# EAGLE design I2C_IR (EAGLE 6.3)
DATABASE: ./../../eagle/PARTSDB.TXT
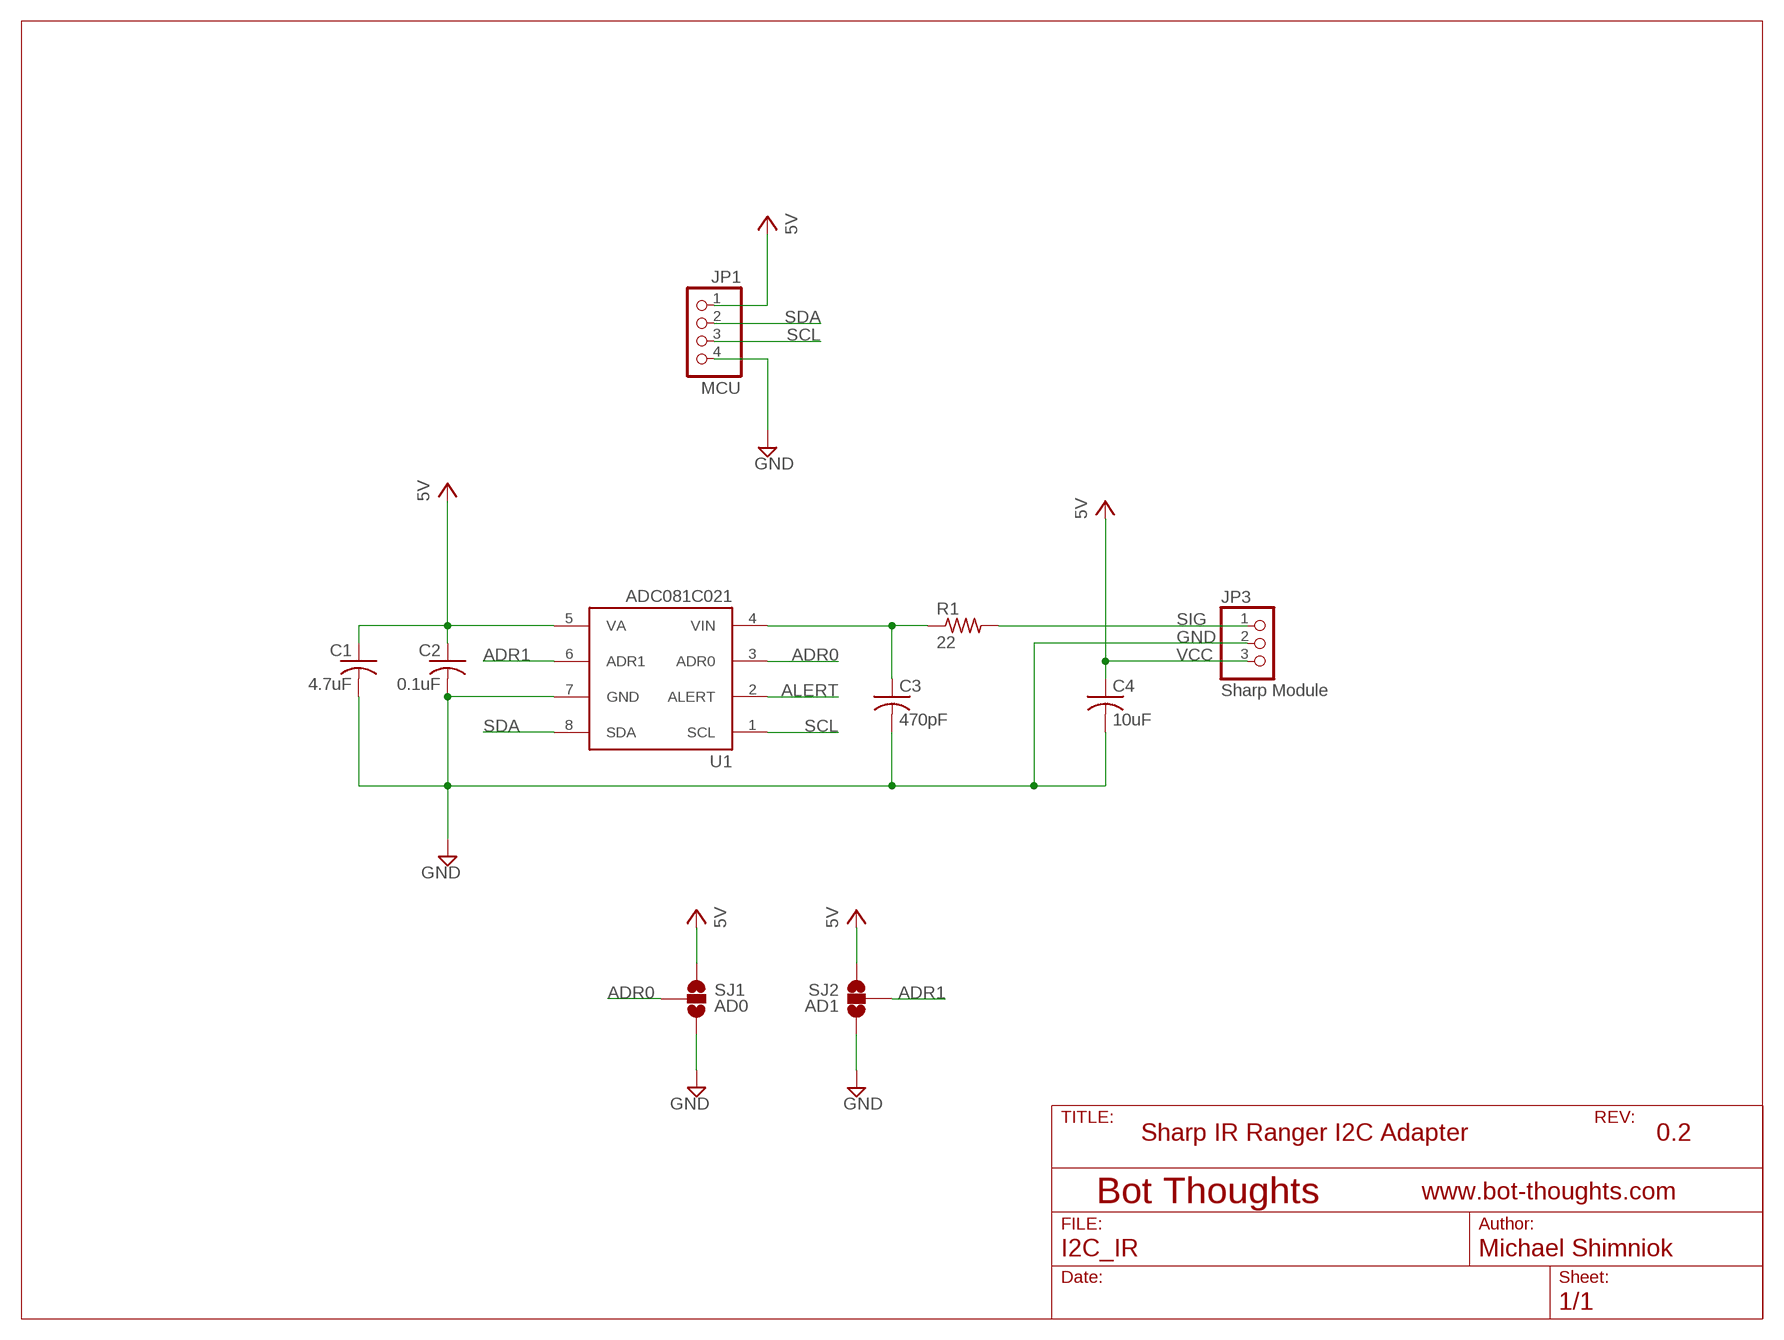
[diagram p0: schematic, sheet 1]

## Parts
C1  4.7uF  C-USC0805K  [C0805K]
C2  0.1uF  C-USC0603  [C0603]
C3  470pF  C-USC0603  [C0603]
C4  10uF  C-USC0805K  [C0805K]
JP1  MCU  PINHD-1X04_2.54-S  [1X04-S]
JP3  Sharp Module  PINHD-1X03_2.00  [1X03M]
R1  22  R-US_R0603  [R0603]
SJ1  AD0  SOLDERJUMPER_2WAYS  [SJ_3]
SJ2  AD1  SOLDERJUMPER_2WAYS  [SJ_3]
U1  ADC081C021  [MSOP8_0.65]

## Nets
ADR0: SJ1.2 U1.3(ADR0)
ADR1: SJ2.2 U1.6(ADR1)
ALERT: U1.2(ALERT)
GND: C1.2 C2.2 C3.2 C4.2 JP1.4 JP3.2 SJ1.3 SJ2.3 U1.7(GND)
N$4: C3.1 R1.1 U1.4(VIN)
SCL: JP1.3 U1.1(SCL)
SDA: JP1.2 U1.8(SDA)
SIG: JP3.1 R1.2
VCC: C1.1 C2.1 C4.1 JP1.1 JP3.3 SJ1.1 SJ2.1 U1.5(VA) ; supply symbol labelled 5V

## Notes on the sheet
- Sharp IR Ranger I2C Adapter | 0.2

## Library data of the parts
C1 = rcl:C-US: CAPACITOR, American symbol; PARTNO: T491A475K010AT
C2-C4 = rcl:C-US: CAPACITOR, American symbol
JP1 = pinhead-2:PINHD-1X04: PIN HEADER
JP3 = pinhead-2:PINHD-1X03: PIN HEADER
R1 = rcl:R-US_: RESISTOR, American symbol
SJ1 SJ2 = SparkFun:SOLDERJUMPER_2WAY: Solder Jumper 2 way solder jumper
U1 = mes_adc:ADC081C021: ADC081C021 / ADC101C021 / ADC121C021 National Semiconductor I2C Analog to Digital Converter. 8-pin version. 6-pin variants either have single address line or alert line

## Board
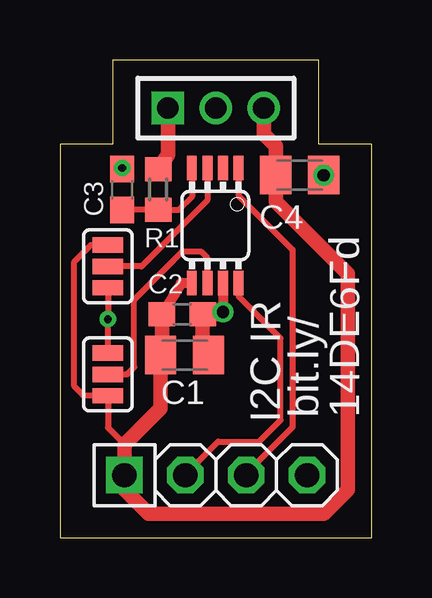
[diagram p1: board, top side]
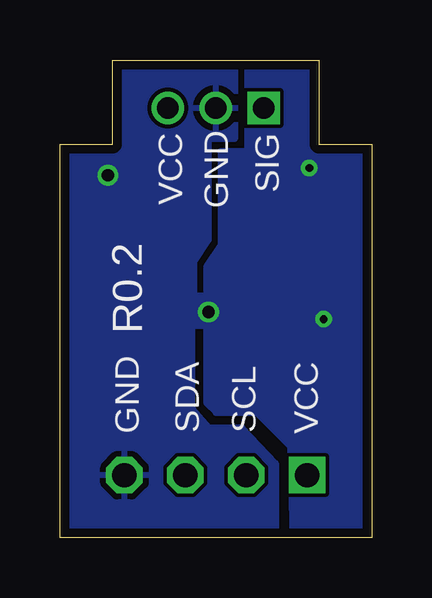
[diagram p2: board, bottom side, seen from below]

Size 13 x 19.9 mm. Coordinates in mm from the lower left corner, seen from the top.
Outline: 2.2,19.9 2.2,16.4 0,16.4 0,0 13,0 13,16.4 10.8,16.4 10.8,19.9 2.2,19.9
Copper layers (1*16): Top 0.0356mm / dielectric 1.5011mm / Bottom 0.0356mm
Design rules "LaenPCBOrder": minimum track width 6mil, minimum drill 13mil, track to track 6mil, track to pad 6mil, pad to pad 6mil, via to via 6mil, smd to smd 6mil, copper to edge 15mil, drill to drill 6mil, minimum pad ring 7mil, minimum via ring 7mil, stop-mask expansion 4mil, vias tented up to drill 20mil, thermal gap 10mil

### Footprints (pad centres in the part's own frame; a part is rotated, then mirrored left to right if it is on the bottom)
C0805K = smd 1.3 x 1.6: 1 -1,0; 2 1,0
C0603 = smd 1.1 x 1: 1 -0.85,0; 2 0.85,0
1X04-S = drill 1.016 square: 1 -3.81,0 | drill 1.016 octagon: 2 -1.27,0; 3 1.27,0; 4 3.81,0
1X03M = drill 0.914 square: 1 -2,0 | drill 0.914: 2 0,0; 3 2,0
R0603 = smd 1 x 1.1: 1 -0.85,0; 2 0.85,0
SJ_3 = smd 0.635 x 1.27: 1 -0.889,0; 2 0,0; 3 0.889,0
MSOP8_0.65 = smd 1.02 x 0.41: 1 -2.4,0.95; 2 -2.4,0.3; 3 -2.4,-0.35; 4 -2.4,-1; 5 2.4,-1; 6 2.4,-0.35; 7 2.4,0.3; 8 2.4,0.95

### Placement (x,y rotation side)
C1  5.2,7.6 0 top
C2  5.1,9.3 0 top
C3  2.6,14.5 90 top
C4  10,15.1 0 top
JP1  6.5,2.6 0 top
JP3  6.5,17.9 0 top
R1  4.1,14.5 90 top
SJ1  2,11.3 270 top
SJ2  2,6.8 90 top
U1  6.5,13 270 top

### Tracks (layer width: path | path; a pad name or v marks a point on that pad's centre or on a via)
ADR0
  Top 0.254: U1.3 6.15,14.05 3.4,11.3 SJ1.2
ADR1
  Top 0.254: 6.1,10.55 U1.6 6.15,11.65 5.9,11.9 5.1,11.9 3.1,9.9 3.1,7.1 2.8,6.8 SJ2.2
GND  (via drill 0.33, 0.51)
  Top 0.254: SJ1.3 v2,9.1 SJ2.3
  Top 0.406: U1.7 v6.8,9.4
  Top 0.61: C3.2 v2.6,15.4 | v6.8,9.4 6.7,9.3 C2.2 5.95,7.65 C1.2
  other vias: 11,15.1
  pour Bottom: 10.8,19.9 5.7,19.9 5.7,16.6 6.8,16.6 6.8,12.4 7.4,11.5 7.4,10.1 6,10.1 6,8.8 7.5,8.8 7.5,5.4 6.8,4.6 5.4,4.6 4,3.1 4,0 13,0 13,16.4 10.8,16.4
  pour Bottom (rank 2): 5.2,19.9 5.2,16.1 6.3,16.1 6.3,12.2 6.9,11.3 6.9,5.6 6.5,5.2 4.8,5.2 3.4,3.8 3.3,0 0,0 0,16.4 2.2,16.4 2.2,19.9
N$4
  Top 0.254: C3.1 R1.1 4.95,13.65 5.5,14.2 U1.4
SCL
  Top 0.254: U1.1 7.45,14.25 9.7,12 9.7,4.6 7.77,2.67 JP1.3
SDA
  Top 0.254: JP1.2 5.23,2.63 6.6,4 8.3,4 9.2,4.9 9.2,8.3 7.45,10.05 U1.8
SIG
  Top 0.61: JP3.1 4.5,15.95 R1.2
VCC
  Top 0.254: 2.69,3.89 2,4.58 SJ2.1 0.99,5.91 0.6,6.3 0.6,11.5 1.29,12.19 SJ1.1
  Top 0.406: U1.5 5.05,10.6 C2.1
  Top 0.61: 8.5,17.45 JP3.3 8.5,16.8 9,16.3 C4.1 9,14 12,11 12,2 11,1 3.7,1 2.7,2 JP1.1 2.69,3.89 4.2,5.4 C1.1 4.25,7.65 C2.1

### Text on the board
tNames: I2C IR | bit.ly/ | 14DE6Fd
bNames: SIG | GND | VCC | R0.2 | VCC | SCL | SDA | GND
tsilk: AD0 | U1 | AD1
bsilk: R0.2 | SIG | GND | VCC | I2CIR | bot-thoughts.com | VCC | SDA | SCL | GND